# EAGLE design design (EAGLE 9.5.2)
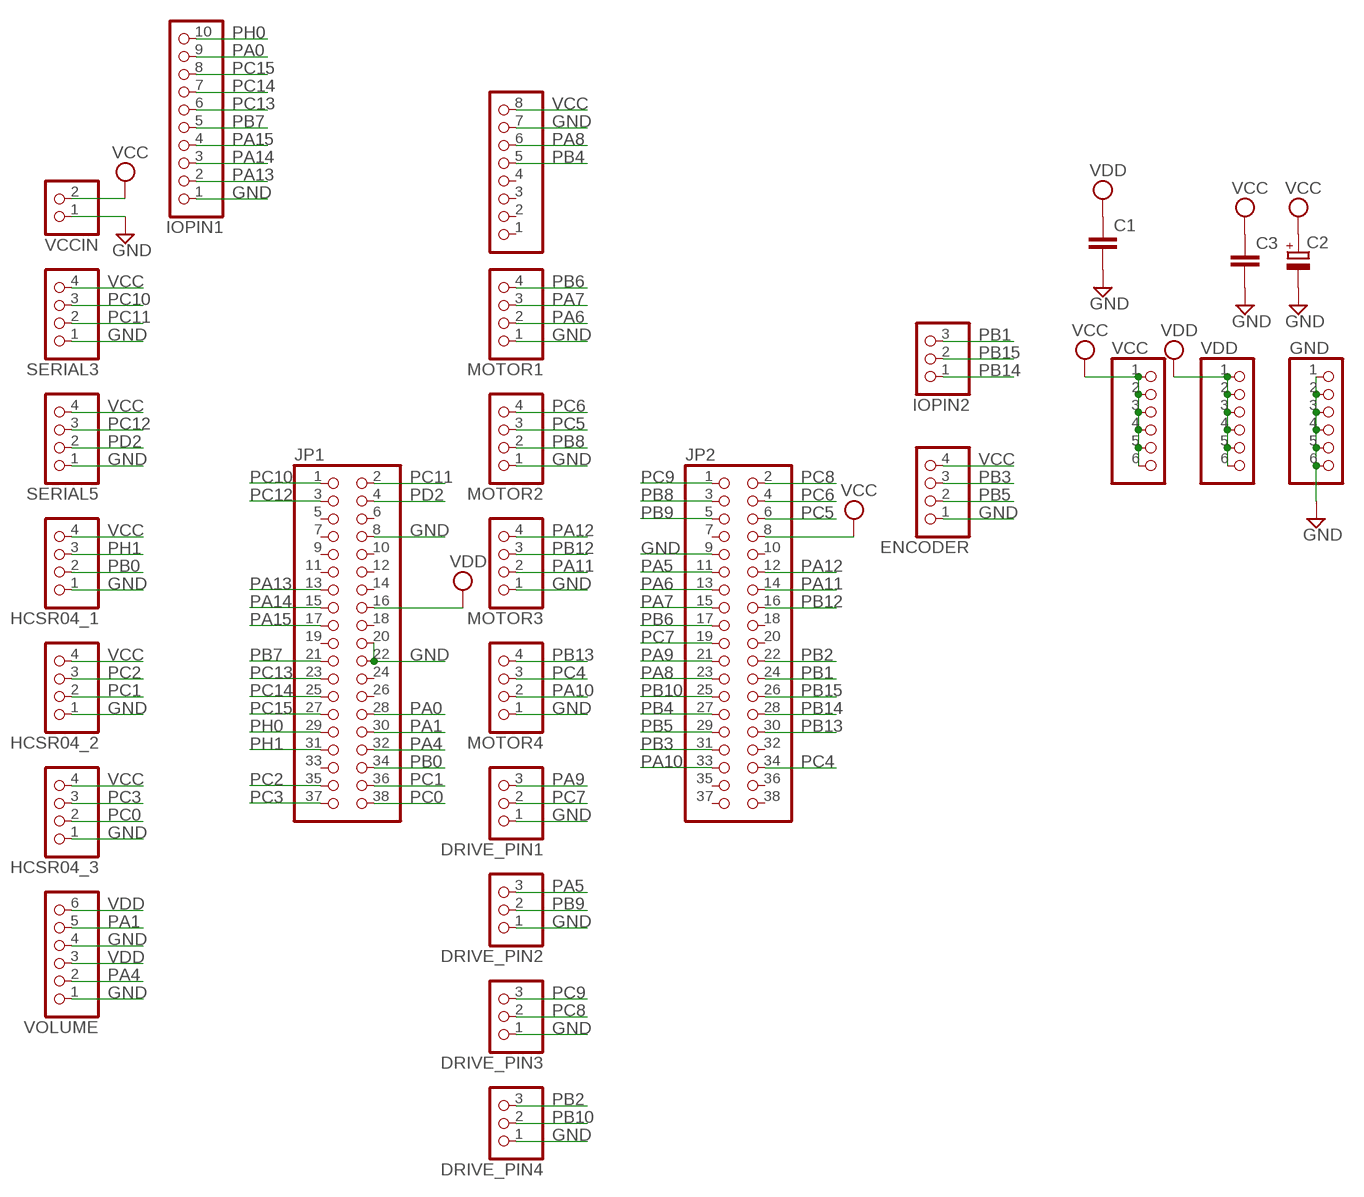
[diagram p0: schematic, sheet 1]

## Parts
C1  C-EU025-024X044  [C025-024X044]
C2  CPOL-EUE2.5-7  [E2,5-7]
C3  C-EU025-024X044  [C025-024X044]
DRIVE_PIN1  ABOUTERS_3PIN  [22-23-2031]
DRIVE_PIN2  ABOUTERS_3PIN  [22-23-2031]
DRIVE_PIN3  ABOUTERS_3PIN  [22-23-2031]
DRIVE_PIN4  ABOUTERS_3PIN  [22-23-2031]
ENCODER  ABOUTERS_4PIN  [22-23-2041]
GND  ABOUTERS_6PIN  [22-23-2061]
HCSR04_1  ABOUTERS_4PIN  [22-23-2041]
HCSR04_2  ABOUTERS_4PIN  [22-23-2041]
HCSR04_3  ABOUTERS_4PIN  [22-23-2041]
IOPIN1  ABOUTERS_10PIN  [22-23-2101]
IOPIN2  ABOUTERS_3PIN  [22-23-2031]
JP1  PINHD-2X19  [2X19]
JP2  PINHD-2X19  [2X19]
JP3  PINHD-1X8  [1X08]
MOTOR1  ABOUTERS_4PIN  [22-23-2041]
MOTOR2  ABOUTERS_4PIN  [22-23-2041]
MOTOR3  ABOUTERS_4PIN  [22-23-2041]
MOTOR4  ABOUTERS_4PIN  [22-23-2041]
SERIAL3  ABOUTERS_4PIN  [22-23-2041]
SERIAL5  ABOUTERS_4PIN  [22-23-2041]
VCC  ABOUTERS_6PIN  [22-23-2061]
VCCIN  ABOUTERS_2PIN  [22-23-2021]
VDD  ABOUTERS_6PIN  [22-23-2061]
VOLUME  ABOUTERS_6PIN  [22-23-2061]

## Nets
GND: C1.2 C2.- C3.2 DRIVE_PIN1.1 DRIVE_PIN2.1 DRIVE_PIN3.1 DRIVE_PIN4.1 ENCODER.1 GND.1 GND.2 GND.3 GND.4 GND.5 GND.6 HCSR04_1.1 HCSR04_2.1 HCSR04_3.1 IOPIN1.1 JP1.8 JP1.20 JP1.22 JP2.9 JP3.7 MOTOR1.1 MOTOR2.1 MOTOR3.1 MOTOR4.1 SERIAL3.1 SERIAL5.1 VCCIN.1 VOLUME.1 VOLUME.4
PA0: IOPIN1.9 JP1.28
PA1: JP1.30 VOLUME.5
PA4: JP1.32 VOLUME.2
PA5: DRIVE_PIN2.3 JP2.11
PA6: JP2.13 MOTOR1.2
PA7: JP2.15 MOTOR1.3
PA8: JP2.23 JP3.6
PA9: DRIVE_PIN1.3 JP2.21
PA10: JP2.33 MOTOR4.2
PA11: JP2.14 MOTOR3.2
PA12: JP2.12 MOTOR3.4
PA13: IOPIN1.2 JP1.13
PA14: IOPIN1.3 JP1.15
PA15: IOPIN1.4 JP1.17
PB0: HCSR04_1.2 JP1.34
PB1: IOPIN2.3 JP2.24
PB2: DRIVE_PIN4.3 JP2.22
PB3: ENCODER.3 JP2.31
PB4: JP2.27 JP3.5
PB5: ENCODER.2 JP2.29
PB6: JP2.17 MOTOR1.4
PB7: IOPIN1.5 JP1.21
PB8: JP2.3 MOTOR2.2
PB9: DRIVE_PIN2.2 JP2.5
PB10: DRIVE_PIN4.2 JP2.25
PB12: JP2.16 MOTOR3.3
PB13: JP2.30 MOTOR4.4
PB14: IOPIN2.1 JP2.28
PB15: IOPIN2.2 JP2.26
PC0: HCSR04_3.2 JP1.38
PC1: HCSR04_2.2 JP1.36
PC2: HCSR04_2.3 JP1.35
PC3: HCSR04_3.3 JP1.37
PC4: JP2.34 MOTOR4.3
PC5: JP2.6 MOTOR2.3
PC6: JP2.4 MOTOR2.4
PC7: DRIVE_PIN1.2 JP2.19
PC8: DRIVE_PIN3.2 JP2.2
PC9: DRIVE_PIN3.3 JP2.1
PC10: JP1.1 SERIAL3.3
PC11: JP1.2 SERIAL3.2
PC12: JP1.3 SERIAL5.3
PC13: IOPIN1.6 JP1.23
PC14: IOPIN1.7 JP1.25
PC15: IOPIN1.8 JP1.27
PD2: JP1.4 SERIAL5.2
PH0: IOPIN1.10 JP1.29
PH1: HCSR04_1.3 JP1.31
VCC: C2.+ C3.1 ENCODER.4 HCSR04_1.4 HCSR04_2.4 HCSR04_3.4 JP2.8 JP3.8 SERIAL3.4 SERIAL5.4 VCC.1 VCC.2 VCC.3 VCC.4 VCC.5 VCC.6 VCCIN.2
VDD: C1.1 JP1.16 VDD.1 VDD.2 VDD.3 VDD.4 VDD.5 VDD.6 VOLUME.3 VOLUME.6
Unconnected: JP1.5 JP1.6 JP1.7 JP1.9 JP1.10 JP1.11 JP1.12 JP1.14 JP1.18 JP1.19 JP1.24 JP1.26 JP1.33 JP2.7 JP2.10 JP2.18 JP2.20 JP2.32 JP2.35 JP2.36 JP2.37 JP2.38 JP3.1 JP3.2 JP3.3 JP3.4

## Library data of the parts
C1 C3 = rcl:C-EU: CAPACITOR, European symbol; SPICEPREFIX: C
C2 = rcl:CPOL-EU: POLARIZED CAPACITOR, European symbol; SPICEPREFIX: C
DRIVE_PIN1-DRIVE_PIN4 IOPIN2 = abouters_pin (1):ABOUTERS_3PIN
ENCODER HCSR04_1-HCSR04_3 MOTOR1-MOTOR4 SERIAL3 SERIAL5 = abouters_pin (1):ABOUTERS_4PIN
GND VCC VDD VOLUME = abouters_pin (1):ABOUTERS_6PIN
IOPIN1 = abouters_pin (1):ABOUTERS_10PIN
JP1 JP2 = pinhead:PINHD-2X19: PIN HEADER
JP3 = pinhead:PINHD-1X8: PIN HEADER
VCCIN = abouters_pin (1):ABOUTERS_2PIN

## Board
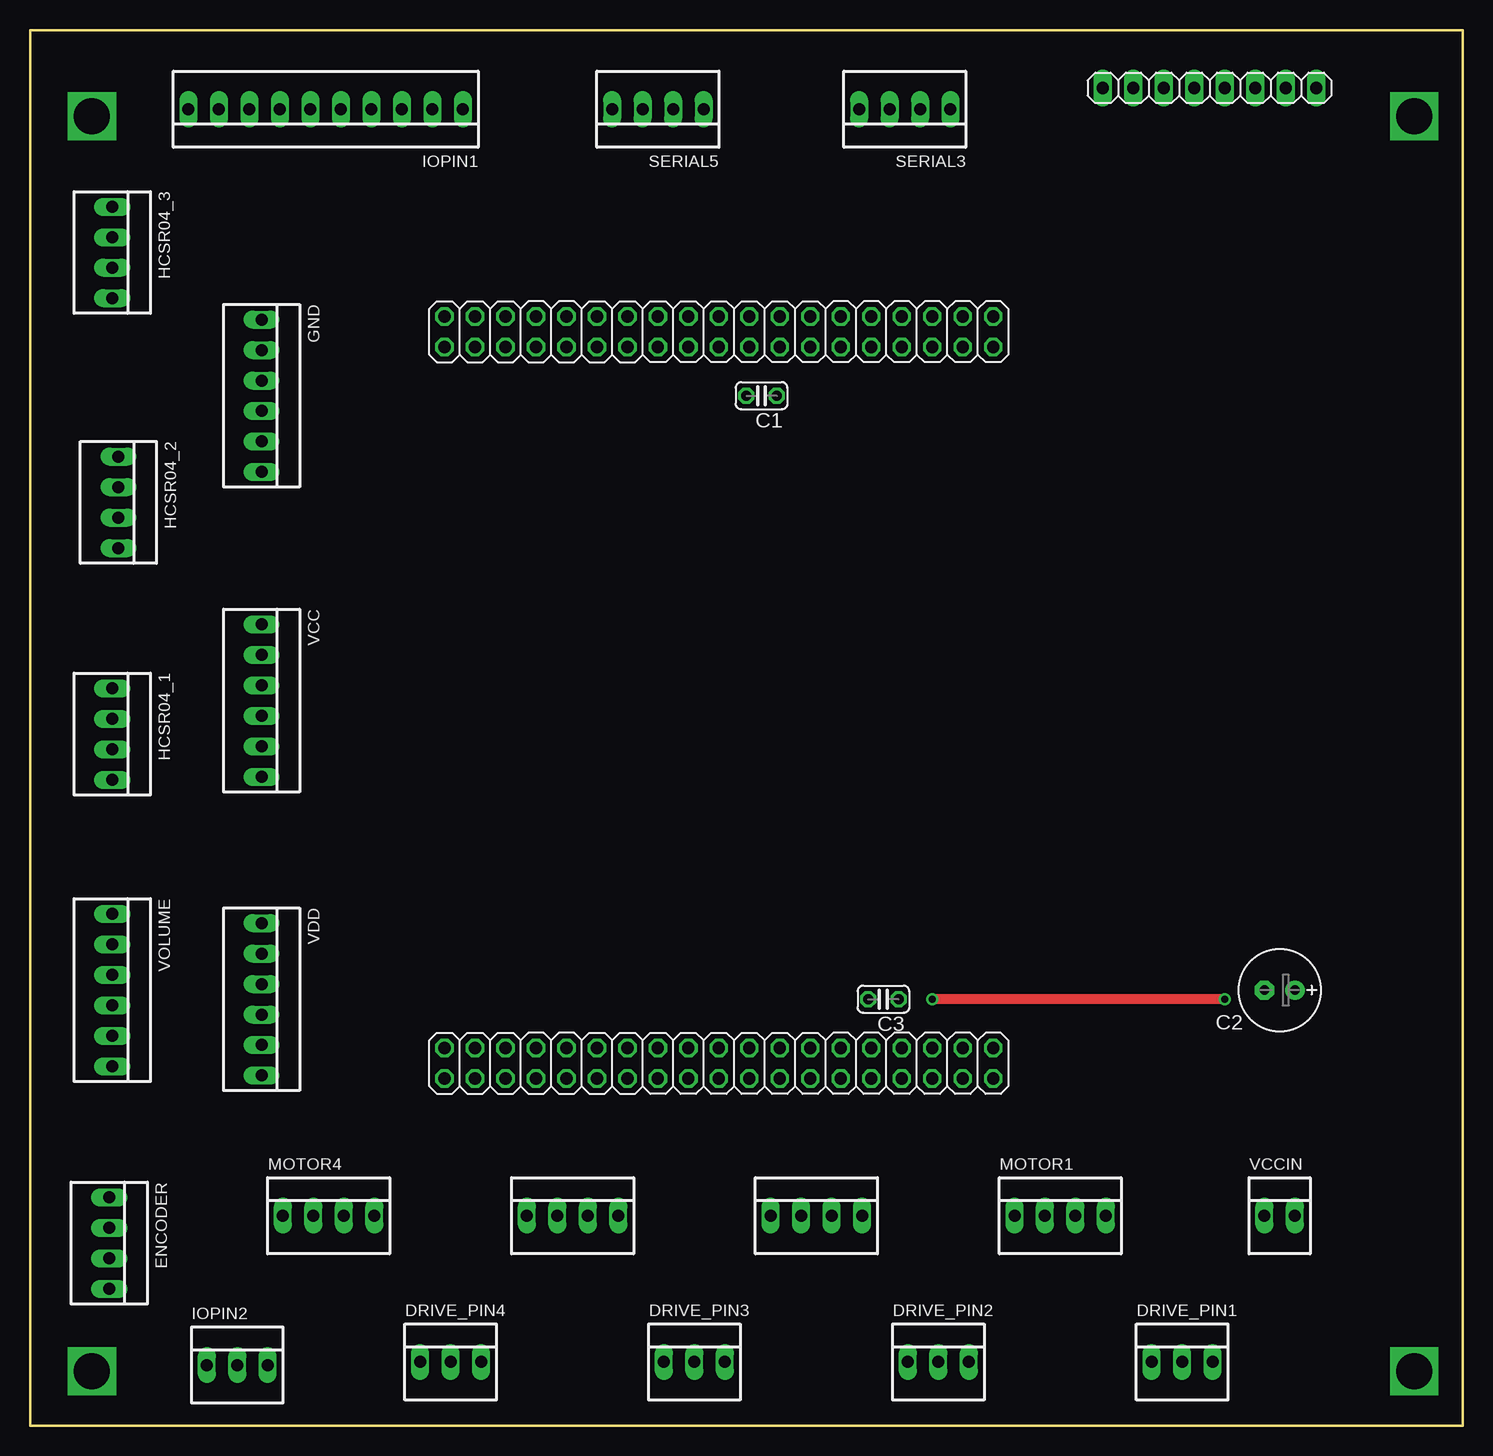
[diagram p1: board, top side]
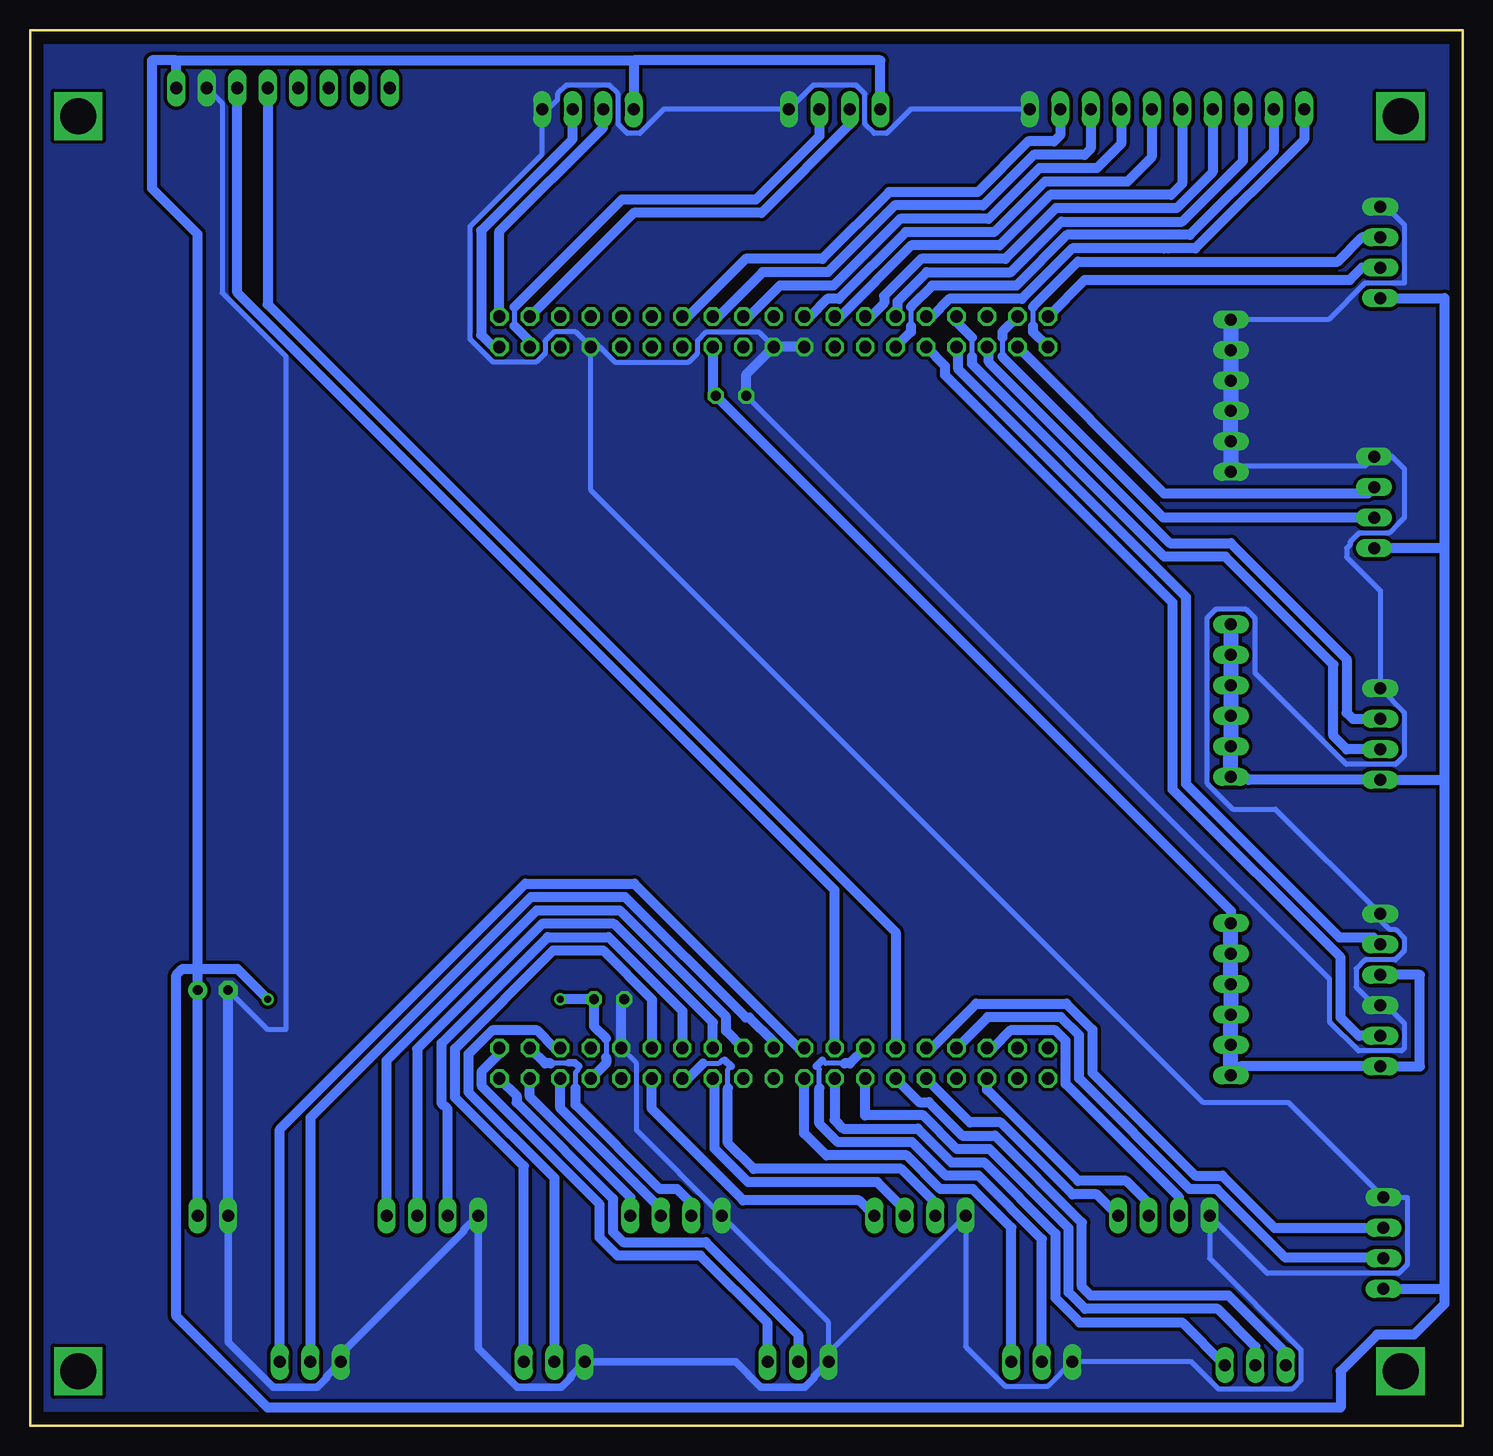
[diagram p2: board, bottom side, seen from below]

Size 119.38 x 116.33 mm. Coordinates in mm from the lower left corner, seen from the top.
Outline: 0,116.33 0,0 119.38,0 119.38,116.33 0,116.33
Copper layers (1*16): Top 0.035mm / dielectric 1.5mm / Bottom 0.035mm
Design rules "default *": minimum track width 6mil, minimum drill 0.35mm, track to track 0.3mm, track to pad 0.3mm, pad to pad 0.3mm, via to via 0.3mm, smd to smd 0.3mm, copper to edge 40mil, drill to drill 6mil, minimum pad ring 10mil, minimum via ring 8mil, stop-mask expansion 4mil, vias tented up to drill 0mil, thermal gap 10mil

### Footprints (pad centres in the part's own frame; a part is rotated, then mirrored left to right if it is on the bottom)
C025-024X044 = drill 0.813 octagon: 1 -1.27,0; 2 1.27,0
E2,5-7 = drill 0.813 pad 1.6: + -1.27,0 | drill 0.813 pad 1.6 octagon: - 1.27,0
22-23-2031 = drill 1 long: 1 -2.54,0; 2 0,0; 3 2.54,0
22-23-2041 = drill 1 long: 1 -3.81,0; 2 -1.27,0; 3 1.27,0; 4 3.81,0
22-23-2061 = drill 1 long: 1 -6.35,0; 2 -3.81,0; 3 -1.27,0; 4 1.27,0; 5 3.81,0; 6 6.35,0
22-23-2101 = drill 1 long: 1 -11.43,0; 2 -8.89,0; 3 -6.35,0; 4 -3.81,0; 5 -1.27,0; 6 1.27,0; 7 3.81,0; 8 6.35,0; 9 8.89,0; 10 11.43,0
2X19 = drill 1.016 octagon: 1 -22.86,-1.27; 2 -22.86,1.27; 3 -20.32,-1.27; 4 -20.32,1.27; 5 -17.78,-1.27; 6 -17.78,1.27; 7 -15.24,-1.27; 8 -15.24,1.27; 9 -12.7,-1.27; 10 -12.7,1.27; 11 -10.16,-1.27; 12 -10.16,1.27; 13 -7.62,-1.27; 14 -7.62,1.27; 15 -5.08,-1.27; 16 -5.08,1.27; 17 -2.54,-1.27; 18 -2.54,1.27; 19 0,-1.27; 20 0,1.27; 21 2.54,-1.27; 22 2.54,1.27; 23 5.08,-1.27; 24 5.08,1.27; 25 7.62,-1.27; 26 7.62,1.27; 27 10.16,-1.27; 28 10.16,1.27; 29 12.7,-1.27; 30 12.7,1.27; 31 15.24,-1.27; 32 15.24,1.27; 33 17.78,-1.27; 34 17.78,1.27; 35 20.32,-1.27; 36 20.32,1.27; 37 22.86,-1.27; 38 22.86,1.27
1X08 = drill 1.016 long: 1 -8.89,0; 2 -6.35,0; 3 -3.81,0; 4 -1.27,0; 5 1.27,0; 6 3.81,0; 7 6.35,0; 8 8.89,0
22-23-2021 = drill 1 long: 1 -1.27,0; 2 1.27,0

### Placement (x,y rotation side)
C1  60.96,85.85 180 top
C2  104.14,36.32 180 top
C3  71.12,35.56 180 top
DRIVE_PIN1  96.01,5.33 0 top
DRIVE_PIN2  75.69,5.33 0 top
DRIVE_PIN3  55.37,5.33 0 top
DRIVE_PIN4  35.05,5.33 0 top
ENCODER  6.6,15.24 270 top
GND  19.3,85.85 270 top
HCSR04_1  6.86,57.66 270 top
HCSR04_2  7.37,76.96 270 top
HCSR04_3  6.86,97.79 270 top
IOPIN1  24.64,109.73 180 top
IOPIN2  17.27,5.08 0 top
JP1  57.4,91.19 180 top
JP2  57.4,30.23 180 top
JP3  98.3,111.51 0 top
MOTOR1  85.85,17.53 0 top
MOTOR2  65.53,17.53 0 top
MOTOR3  45.21,17.53 0 top
MOTOR4  24.89,17.53 0 top
SERIAL3  72.9,109.73 180 top
SERIAL5  52.32,109.73 180 top
VCC  19.3,60.45 270 top
VCCIN  104.14,17.53 0 top
VDD  19.3,35.56 270 top
VOLUME  6.86,36.32 270 top

### Tracks (layer width: path | path; a pad name or v marks a point on that pad's centre or on a via)
GND
  Bottom 0.406: JP2.9 68.83,30.22 68.83,24.63 MOTOR2.1 52.83,8.64 DRIVE_PIN3.1 52.83,6.1 MOTOR3.1 41.4,6.61 38.11,3.32 34.53,3.32 DRIVE_PIN4.1 22.6,5.33 20.33,3.07 14.21,3.07 13.48,3.81 13.48,6.36 21.08,13.96 MOTOR4.1 16.27,12.71 5.33,12.71 4.59,13.45 4.59,19.05 ENCODER.1 14.49,26.94 21.6,26.94 72.64,77.99 JP1.8 | JP1.8 71.89,89.92 70.63,88.65 64.5,88.65 63.75,89.4 63.75,90.44 63.01,91.18 58.67,91.18 JP1.20 | 76.71,109.22 76.71,105.98 82.7,99.99 82.7,90.55 80.79,88.65 77.2,88.65 76.46,89.39 76.46,90.43 75.71,91.18 73.91,91.18 JP1.8 | 76.71,109.22 SERIAL3.1 | JP3.7 103.37,110.23 103.37,94.42 98.04,89.09 98.04,33.02 99.57,33.02 C2.- | IOPIN1.1 45.98,109.73 47.99,107.72 49.03,107.72 49.8,108.48 49.8,111 50.53,111.74 54.11,111.74 SERIAL5.1 66.56,109.73 68.57,107.72 69.61,107.72 70.37,108.48 70.37,111 71.11,111.74 74.69,111.74 75.43,111 75.43,110.5 76.71,109.22 | HCSR04_3.1 6.36,101.6 4.85,100.09 4.85,95.24 8.13,95.24 11.17,92.2 GND.1 | GND.6 18.8,80.01 8.13,80.01 HCSR04_2.1 5.85,80.77 4.85,79.77 4.85,75.69 5.36,75.18 5.36,75.17 6.12,74.41 8.64,74.41 9.38,73.67 9.38,73.43 9.65,73.15 9.65,72.4 6.86,69.6 HCSR04_1.1 4.85,59.45 4.85,55.87 5.58,55.13 9.68,55.13 17.29,62.74 17.29,67.32 18.03,68.06 20.58,68.06 21.32,67.32 21.32,53.58 19.15,51.41 15.6,51.41 VOLUME.1 6.86,42.16 6.09,41.39 5.58,41.39 4.85,40.65 4.85,39.61 5.61,38.85 8.13,38.85 8.87,38.11 8.87,36.56 7.36,35.05 VOLUME.4 6.36,35.05 4.85,33.54 4.85,31.48 5.08,31.26 8.66,31.26 11.07,33.66 11.07,37.23 C1.2
  Bottom 0.61: DRIVE_PIN3.1 54.01,4.15 54.01,4.02 54.81,3.22 58.48,3.22 60.59,5.33 DRIVE_PIN2.1 74.33,4.15 74.33,4.02 75.13,3.22 78.8,3.22 82.04,6.47 MOTOR1.1 83.22,16.34 83.22,16.21 93.47,5.96 DRIVE_PIN1.1 94.65,4.15 94.65,4.02 95.45,3.22 99.12,3.22 102.87,6.98 VCCIN.1
  Bottom 0.813: JP1.22 JP1.20 59.69,87.63 C1.2 | VCCIN.1 C2.- | JP2.9 70.1,35.31 C3.2
  Bottom 1.27: GND.1 GND.2 GND.3 GND.4 GND.5 GND.6
  pour Bottom (no thermals): -0.51,117.86 -0.51,-1.02 119.89,-1.02 119.89,117.86
N$1  (via drill 3)
  other vias: 5.16,109.16
N$2  (via drill 3)
  other vias: 5.16,4.56
N$3  (via drill 3)
  other vias: 115.36,109.16
N$4  (via drill 3)
  other vias: 115.36,4.56
PA0
  Bottom 0.406: 45.97,93.26 45.97,91.65
  Bottom 0.813: IOPIN1.9 15.75,106.22 22.72,99.25 32.97,99.25 37.19,95.04 44.2,95.04 45.97,93.26 | JP1.28 45.97,91.19 45.97,91.65
PA1
  Bottom 0.813: VOLUME.5 8.64,32.51 10.16,34.04 10.16,39.04 24.15,53.04 24.15,68.62 43.12,87.58 43.12,88.33 JP1.30
PA4
  Bottom 0.813: VOLUME.2 7.43,40.7 10.25,40.7 23.04,53.5 23.04,69.08 42.01,88.04 42.01,89.76 JP1.32
PA5
  Bottom 0.813: DRIVE_PIN2.3 78.23,21.64 83.96,27.37 83.96,31.45 75.79,39.62 71.63,39.62 67.56,35.56 JP2.11
PA6
  Bottom 0.813: MOTOR1.2 84.58,26.42 85.07,26.91 85.07,31.91 76.25,40.74 71.17,40.74 65.02,34.59 JP2.13
PA7
  Bottom 0.813: MOTOR1.3 87.12,31.44 76.71,41.85 70.71,41.85 62.48,33.63 JP2.15
PA8
  Bottom 0.813: JP2.23 52.32,44.65 102.11,94.44 JP3.6
PA9
  Bottom 0.813: DRIVE_PIN1.3 98.55,24.73 78.09,45.19 69.01,45.19 55.32,31.5 JP2.21
PA10
  Bottom 0.813: MOTOR4.2 23.62,19.05 33.08,28.5 33.08,32.1 33.94,32.96 37.69,32.96 39.16,31.5 JP2.33
PA11
  Bottom 0.406: 60.96,29.97 61.21,29.72 61.21,28.15 | 61.47,30.48 61.71,30.48 61.96,30.23 63.29,30.23
  Bottom 0.61: 61.47,30.48 60.96,29.97
  Bottom 0.813: MOTOR3.2 43.94,18.59 46.78,21.43 59.07,21.43 61.21,23.58 61.21,28.15 | JP2.14 64.56,28.96 63.29,30.23
PA12
  Bottom 0.813: MOTOR3.4 50.29,18.8 59.94,18.8 67.56,26.42 JP2.12
PA13
  Bottom 0.813: IOPIN1.2 33.53,107.55 34.04,107.04 36.2,107.04 40.41,102.83 47.78,102.83 53.35,97.26 59.75,97.26 64.56,92.46 JP1.13
PA14
  Bottom 0.813: IOPIN1.3 30.99,106.44 31.5,105.93 35.74,105.93 39.95,101.71 47.32,101.71 52.89,96.15 58.33,96.15 62.02,92.46 JP1.15
PA15
  Bottom 0.813: IOPIN1.4 28.45,106.85 30.48,104.82 35.28,104.82 39.49,100.6 46.86,100.6 52.43,95.04 56.9,95.04 59.48,92.46 JP1.17
PB0
  Bottom 0.813: JP1.34 39.47,89.76 39.47,88.65 24.38,73.56 19.3,73.56 9.65,63.91 9.65,59.44 9.14,58.93 HCSR04_1.2
PB1
  Bottom 0.813: JP2.24 52.32,25.5 51.6,24.77 45.4,24.77 42.59,21.97 39.88,21.97 33.94,16.03 33.94,10.67 31.91,8.64 23.37,8.64 IOPIN2.3
PB2
  Bottom 0.813: DRIVE_PIN4.3 37.59,16.54 40.8,19.74 43.52,19.74 46.32,22.55 53.03,22.55 54.86,24.38 JP2.22
PB3
  Bottom 0.813: ENCODER.3 6.67,14.03 14.77,14.03 20.48,19.74 22.74,19.74 31.96,28.96 31.96,32.56 33.47,34.08 39.58,34.08 JP2.31
PB4
  Bottom 0.813: JP3.5 99.57,93.47 47.24,41.15 JP2.27
PB5
  Bottom 0.813: JP2.29 44.24,31.5 40.55,35.19 33.01,35.19 30.85,33.03 30.85,29.43 22.28,20.85 20.02,20.85 15.67,16.51 ENCODER.2
PB6
  Bottom 0.813: MOTOR1.4 89.66,30.47 77.17,42.96 70.25,42.96 61.37,34.09 61.37,32.92 JP2.17
PB7
  Bottom 0.813: IOPIN1.5 25.91,105.74 27.94,103.7 34.81,103.7 39.03,99.49 46.4,99.49 51.97,93.92 52.93,93.92 54.4,92.46 JP1.21
PB8
  Bottom 0.406: 73.91,28.15 73.91,29.48 73.66,29.73 73.66,29.97 | 74.47,30.28 74.62,30.28 74.67,30.23 75.99,30.23
  Bottom 0.61: 73.66,29.97 73.96,30.28 74.47,30.28
  Bottom 0.813: MOTOR2.2 64.26,18.54 65.46,19.74 66.89,19.74 73.91,26.77 73.91,28.15 | JP2.3 76.45,30.23 75.99,30.23
PB9
  Bottom 0.813: JP2.5 75.65,31.5 77.12,32.96 80.87,32.96 82.84,30.99 82.84,27.83 75.69,20.68 DRIVE_PIN2.2
PB10
  Bottom 0.406: 53.59,28.15 53.59,29.72 53.85,29.97 | 51.52,30.23 53.09,30.23 53.34,30.48
  Bottom 0.61: 53.34,30.48 53.85,29.97
  Bottom 0.813: DRIVE_PIN4.2 35.05,15.57 40.34,20.85 43.06,20.85 45.86,23.66 52.06,23.66 53.59,25.2 53.59,28.15 | JP2.25 51.05,30.23 51.52,30.23
PB12
  Bottom 0.813: MOTOR3.3 46.48,18.03 48.77,20.32 59.53,20.32 62.33,23.12 62.33,28.8 JP2.16
PB13
  Bottom 0.813: JP2.30 41.05,25.3 38.49,25.3 32.49,19.3 30.48,19.3 MOTOR4.4
PB14
  Bottom 0.813: IOPIN2.1 14.73,6.1 19.5,10.86 30.99,10.86 31.71,11.59 31.71,16.95 38.95,24.19 41.67,24.19 44.48,27 45.28,27 JP2.28
PB15
  Bottom 0.813: IOPIN2.2 17.27,6.6 20.42,9.75 31.45,9.75 32.83,11.13 32.83,16.49 39.41,23.08 42.13,23.08 44.94,25.88 49.78,25.88 JP2.26
PC0
  Bottom 0.406: 35.81,93.26 35.81,91.65
  Bottom 0.813: HCSR04_3.2 8.38,99.06 10.41,97.03 32.05,97.03 35.81,93.26 | JP1.38 35.81,91.19 35.81,91.65
PC1
  Bottom 0.813: HCSR04_2.2 7.87,77.72 24.89,77.72 JP1.36
PC2
  Bottom 0.406: 38.35,90.72 38.35,89.11
  Bottom 0.813: HCSR04_2.3 24.94,75.69 38.35,89.11 | JP1.35 38.35,91.19 38.35,90.72
PC3
  Bottom 0.813: JP1.37 31.5,95.5 9.4,95.5 8.38,96.52 HCSR04_3.3
PC4
  Bottom 0.813: MOTOR4.3 26.16,18.54 28.04,20.42 32.03,20.42 39.62,28.01 JP2.34
PC5
  Bottom 0.813: MOTOR2.3 66.8,18.08 75.18,26.47 JP2.6
PC6
  Bottom 0.813: MOTOR2.4 69.34,19.05 77.72,27.43 JP2.4
PC7
  Bottom 0.813: JP2.19 57.4,32 59.44,34.04 59.75,34.04 69.78,44.07 77.63,44.07 96.01,25.69 DRIVE_PIN1.2
PC8
  Bottom 0.813: JP2.2 78.84,27.53 78.84,26.97 70.8,18.94 70.8,16.17 69.95,15.31 63.06,15.31 55.37,7.62 DRIVE_PIN3.2
PC9
  Bottom 0.813: DRIVE_PIN3.3 57.91,8.59 63.53,14.2 70.41,14.2 71.92,15.71 71.92,18.48 81.73,28.29 81.73,29.56 80.26,31.03 JP2.1
PC10
  Bottom 0.813: JP1.1 80.26,99.57 71.63,108.2 SERIAL3.3
PC11
  Bottom 0.813: JP1.2 80.77,89.92 81.79,90.93 81.79,99.62 74.17,107.24 SERIAL3.2
PC12
  Bottom 0.813: SERIAL5.3 51.05,108.46 58.42,101.09 69.09,101.09 JP1.3
PC13
  Bottom 0.813: IOPIN1.6 23.37,103.51 24.29,102.59 34.35,102.59 38.57,98.38 45.94,98.38 51.86,92.46 JP1.23
PC14
  Bottom 0.813: IOPIN1.7 20.83,104.48 21,104.31 23.83,101.48 33.89,101.48 38.11,97.26 45.12,97.26 48.2,94.19 48.2,93.58 49.32,92.46 JP1.25
PC15
  Bottom 0.813: JP1.27 47.09,92.61 47.09,93.72 44.66,96.15 37.65,96.15 33.43,100.37 23.37,100.37 18.29,105.45 IOPIN1.8
PD2
  Bottom 0.406: 78.99,91.65 78.99,93.26
  Bottom 0.813: JP1.4 77.72,90.38 78.99,91.65 | SERIAL5.2 53.59,107.49 58.88,102.2 70.05,102.2 78.99,93.26
PH0
  Bottom 0.813: JP1.29 44.24,92.46 42.77,93.92 36.73,93.92 32.51,98.14 24.89,98.14 24.52,98.14 22.25,98.14 13.21,107.19 IOPIN1.10
PH1
  Bottom 0.406: 40.89,90.72 40.89,89.11
  Bottom 0.813: HCSR04_1.3 9.65,56.39 10.77,57.5 10.77,63.45 19.77,72.45 24.84,72.45 40.89,88.5 40.89,89.11 | JP1.31 42.16,91.99 40.89,90.72
VCC  (via drill 0.6)
  Top 0.813: v99.57,35.56 v75.18,35.56
  Bottom 0.406: 71.37,32.3 71.37,30.69
  Bottom 0.813: VCCIN.2 C2.+ 105.41,38.1 | VCC.6 18.08,54.1 17.83,53.85 HCSR04_1.4 1.52,53.85 | 107.19,113.79 109.22,113.79 109.22,103.12 105.41,99.31 105.41,38.1 | 107.19,113.79 69.09,113.79 | 69.09,113.79 SERIAL3.4 | JP3.8 107.19,113.79 | SERIAL5.4 48.51,113.79 69.09,113.79 | HCSR04_3.4 1.52,93.98 1.52,73.15 | 1.52,73.15 HCSR04_2.4 | 1.52,73.15 1.52,53.85 | ENCODER.4 1.52,11.43 | 1.52,53.85 1.52,11.43 | 1.52,11.43 1.52,10.16 4.06,7.62 7.12,7.62 10.16,4.58 10.16,1.52 99.57,1.52 107.19,9.14 107.19,37.59 106.68,38.1 105.41,38.1 | 71.37,32.3 72.39,33.32 C3.1 v75.18,35.56 | JP2.8 71.37,30.23 71.37,30.69 | 105.41,38.1 102.11,38.1 v99.57,35.56
  Bottom 1.27: VCC.1 VCC.2 VCC.3 VCC.4 VCC.5 VCC.6
VDD
  Bottom 0.813: VDD.6 18.54,29.97 VOLUME.6 3.56,29.97 3.56,37.59 VOLUME.3 | JP1.16 62.48,86.11 C1.1 19.3,42.93 VDD.1
  Bottom 1.27: VDD.6 VDD.5 VDD.4 VDD.3 VDD.2 VDD.1